# Altium schematic sheet HEADERS_HAS_CCU.SchDoc: CCU - Headers/Power
size B; DrawnBy: M. Seago; Organization: Gravitas; Address1: Sponsored By:; Address2: Alan Morgan; Address3: Technical Advisor:; Address4: Dr. Joseph Morgan; Revision: 1A; SheetNumber: 9; SheetTotal: 9
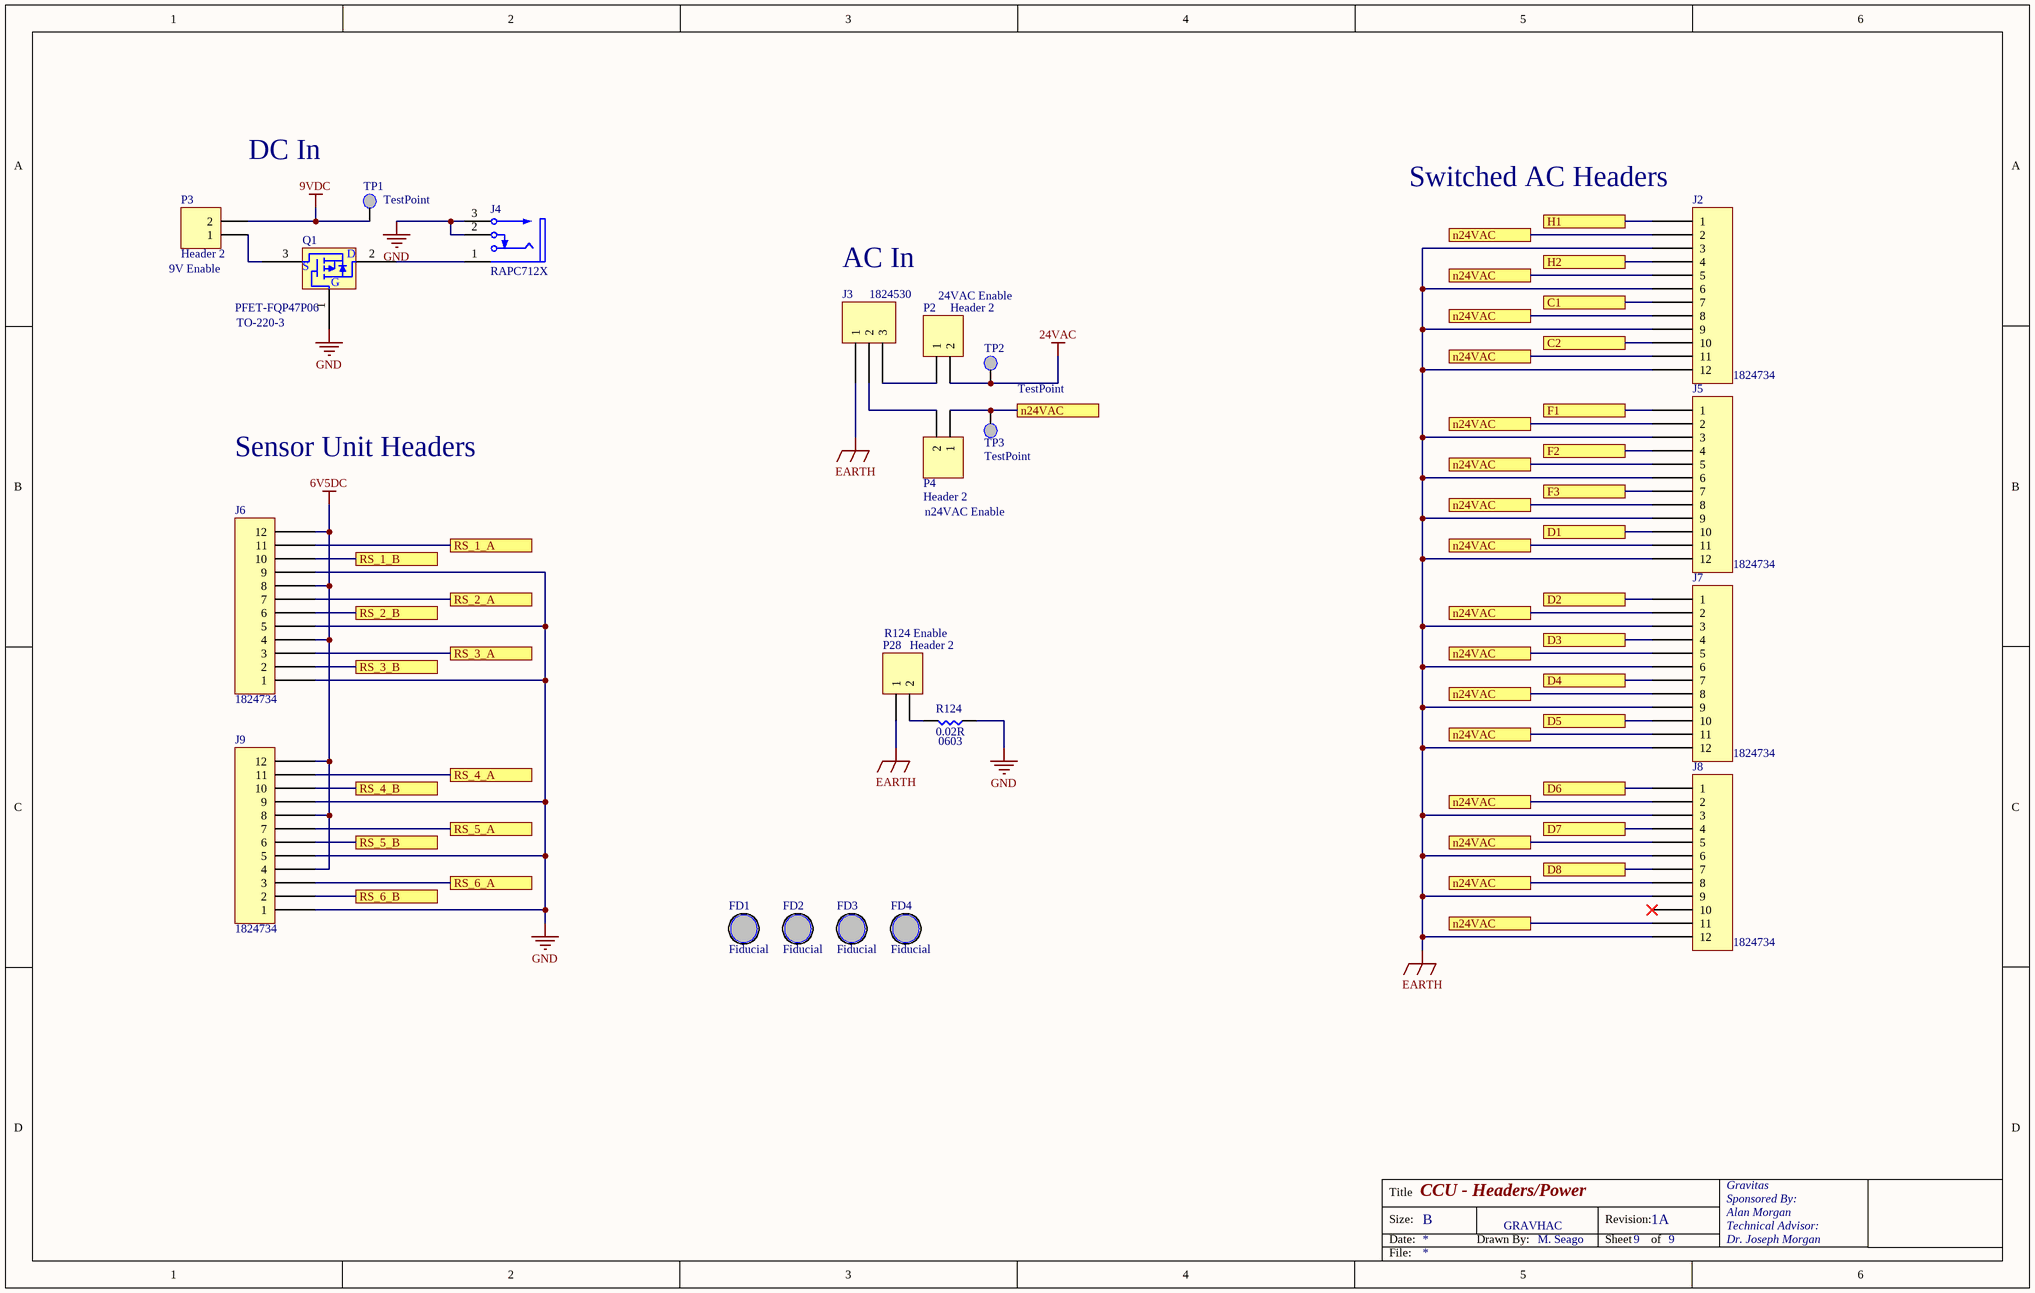
[diagram p0: HEADERS_HAS_CCU.SchDoc]

## Parts
FD1  Fiducial  [Fiducial]
FD2  Fiducial  [Fiducial]
FD3  Fiducial  [Fiducial]
FD4  Fiducial  [Fiducial]
J2  1824734  [1824734]
J3  1824530  [1824530]
J4  RAPC712X  [SWITCH-RAPC712X-3_V]
J5  1824734  [1824734]
J6  1824734  [1824734]
J7  1824734  [1824734]
J8  1824734  [1824734]
J9  1824734  [1824734]
P2  Header 2  [HDR1X2]
P3  Header 2  [HDR1X2]
P4  Header 2  [HDR1X2]
P28  Header 2  [HDR1X2]
Q1  PFET-FQP47P06  [3-PIn?]
R124  0.02R  [NonPolar-0603]
TP1  TestPoint  [TP - S2751-46R]
TP2  TestPoint  [TP - S2751-46R]
TP3  TestPoint  [TP - S2751-46R]

## Ports
C1, C2, D1, D2, D3, D4, D5, D6, D7, D8, F1, F2, F3, H1, H2, n24VAC, RS_1_A, RS_1_B, RS_2_A, RS_2_B, RS_3_A, RS_3_B, RS_4_A, RS_4_B, RS_5_A, RS_5_B, RS_6_A, RS_6_B

## Nets
6V5DC: J6.4 J6.8 J6.12 J9.4 J9.8 J9.12
9VDC: P3.2 TP1.1
24VAC: P2.2 TP2.1
EARTH: J2.3 J2.6 J2.9 J2.12 J3.1 J5.3 J5.6 J5.9 J5.12 J7.3 J7.6 J7.9 J7.12 J8.3 J8.6 J8.9 J8.12 P28.1
GND: J4.2 J4.3 J6.1 J6.5 J6.9 J9.1 J9.5 J9.9 Q1.1 R124.2
C1: J2.7 ; port C1
C2: J2.10 ; port C2
D1: J5.10 ; port D1
D2: J7.1 ; port D2
D3: J7.4 ; port D3
D4: J7.7 ; port D4
D5: J7.10 ; port D5
D6: J8.1 ; port D6
D7: J8.4 ; port D7
D8: J8.7 ; port D8
F1: J5.1 ; port F1
F2: J5.4 ; port F2
F3: J5.7 ; port F3
H1: J2.1 ; port H1
H2: J2.4 ; port H2
n24VAC: J2.2 J2.5 J2.8 J2.11 J5.2 J5.5 J5.8 J5.11 J7.2 J7.5 J7.8 J7.11 J8.2 J8.5 J8.8 J8.11 P4.1 TP3.1 ; port n24VAC
RS_1_A: J6.11 ; port RS_1_A
RS_1_B: J6.10 ; port RS_1_B
RS_2_A: J6.7 ; port RS_2_A
RS_2_B: J6.6 ; port RS_2_B
RS_3_A: J6.3 ; port RS_3_A
RS_3_B: J6.2 ; port RS_3_B
RS_4_A: J9.11 ; port RS_4_A
RS_4_B: J9.10 ; port RS_4_B
RS_5_A: J9.7 ; port RS_5_A
RS_5_B: J9.6 ; port RS_5_B
RS_6_A: J9.3 ; port RS_6_A
RS_6_B: J9.2 ; port RS_6_B
NetJ3_2: J3.2 P4.2
NetJ3_3: J3.3 P2.1
NetJ4_1: J4.1 Q1.2
NetP3_1: P3.1 Q1.3
NetP28_2: P28.2 R124.1

Not connected (* = marked no-connect by the designer): J8 10*

## Notes on the sheet
- DC In
- (near J2) Switched AC Headers
- (near P3) 9V Enable
- AC In
- 24VAC Enable
- (near Q1) TO-220-3
- Sensor Unit Headers
- n24VAC Enable
- R124 Enable
- (near R124) 0603
- GRAVHAC
- Title
- Size:
- Date:
- B
- Drawn By:
- Revision:
- Sheet
- of
- File:
- (in symbol PFET-FQP47P06) D; S; G

## Library data of the parts
FD1-FD4 = Fiducial: 1mm pad, 2mm mask, 2mm KO
J4 = CMP-2000-05383-1: Conn Powerjack Mini R/A PCMT, 5 A, 3-Pin THD, RoHS; Manufacturer: Switchcraft; Gender: Male; Current Rating: 5A; Connector Type: Jack; Dynamic Catalog: SwitchcraftInc; Other Names: Q2387461 / Q2526383 / RAPC712X-ND / SC237; Internal Switch(s): SingleSwitch,NormallyClosed; Catalog Drawings: RAPC7(1,2)2XSide / RAPC7(1,2)2XTop; Plug/Mating Plug Diameter: 2.5mmID,5.5mmOD; Number of Positions/Contacts: 2Conductors,2Contacts; Shielding: Unshielded; Mating Products: SC1539-ND / -CONNPLUGMINIPWR2CONDBLK/RED / SC1051-ND / -CONNPLUGMINIPOWER2CONDBLACK; Mounting Type: ThroughHole,RightAngle; Manufacturer URL: http://www.switchcraft.com/; Contact Material: Brass; Standard Package: 2,500; RoHS Information: SwitchcraftRoHSInfo; Termination: SolderEyelet(s); Housing Color: Black; Datasheet Version: Rev. A, 08/2005; Family: Barrel-PowerConnectors; Housing Material: Thermoplastic; Color: Black; Datasheet URL: https://datasheet.ciiva.com/391/rapc712x-cd-391666.pdf; Category: Connectors,Interconnects; Contact Material - Plating: Nickel
P2-P4 P28 = Header 2: Header, 2-Pin; LatestRevisionDate: 17-Jul-2002; LatestRevisionNote: Re-released for DXP Platform.; Publisher: Altium Limited
R124 = Res - 0603
TP1-TP3 = TestPoint: S2751-46R